# Altium project WeatherStationMain.PrjPCB
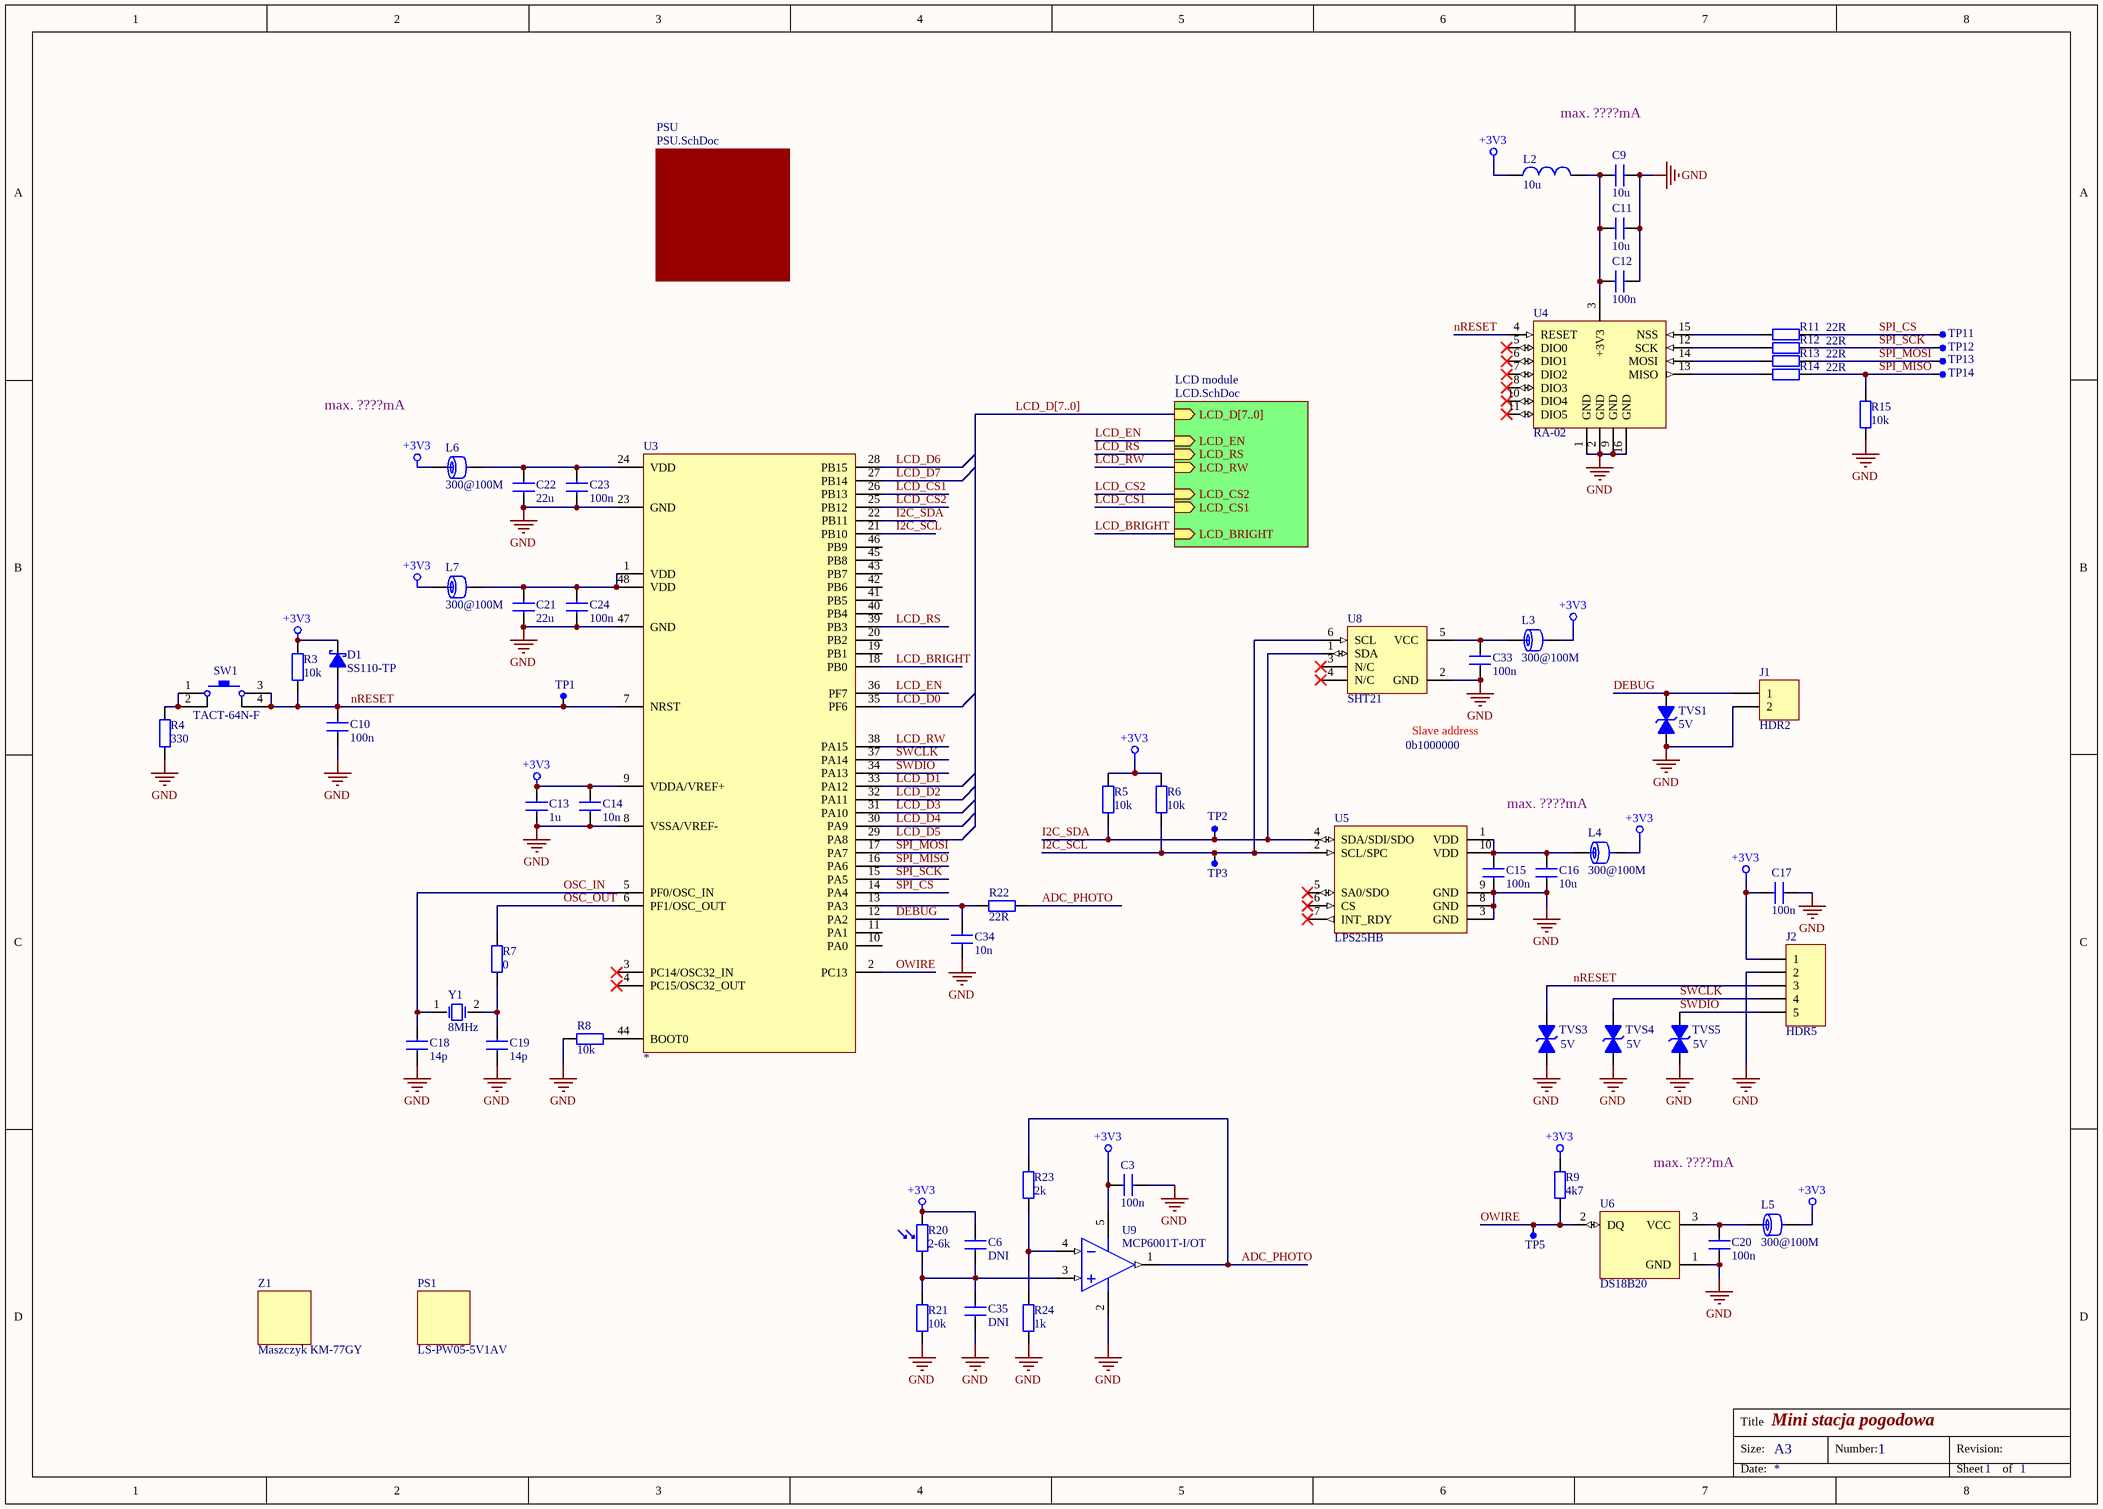
[diagram p0: Main.SchDoc]
.revision: 1.0
3 sheets, 109 parts. Net scope: hierarchical (ports join the sheet entries above them; power ports are global).
Board file: PCB.PcbDoc
Sheets:
  Main.SchDoc
    LCD module = LCD.SchDoc
    PSU = PSU.SchDoc

## Sheet Main.SchDoc: Mini stacja pogodowa
size A3; DrawnBy: Damian Dolewski; Engineer: Damian Dolewski; DocumentNumber: 1; Revision: 1.0; SheetNumber: 1; SheetTotal: 1

### Parts
C3  value 100n  [C_0805]  (hidden comment: Capacitor)
C6  value DNI  [C_0805]  (hidden comment: Capacitor)
C9  value 10u  [C_0805]  (hidden comment: Capacitor)
C10  value 100n  [C_0805]  (hidden comment: Capacitor)
C11  value 10u  [C_0805]  (hidden comment: Capacitor)
C12  value 100n  [C_0805]  (hidden comment: Capacitor)
C13  value 1u  [C_0805]  (hidden comment: Capacitor)
C14  value 10n  [C_0805]  (hidden comment: Capacitor)
C15  value 100n  [C_0805]  (hidden comment: Capacitor)
C16  value 10u  [C_0805]  (hidden comment: Capacitor)
C17  value 100n  [C_0805]  (hidden comment: Capacitor)
C18  value 14p  [C_0805]  (hidden comment: Capacitor)
C19  value 14p  [C_0805]  (hidden comment: Capacitor)
C20  value 100n  [C_0805]  (hidden comment: Capacitor)
C21  value 22u  [C_0805]  (hidden comment: Capacitor)
C22  value 22u  [C_0805]  (hidden comment: Capacitor)
C23  value 100n  [C_0805]  (hidden comment: Capacitor)
C24  value 100n  [C_0805]  (hidden comment: Capacitor)
C33  value 100n  [C_0805]  (hidden comment: Capacitor)
C34  value 10n  [C_0805]  (hidden comment: Capacitor)
C35  value DNI  [C_0805]  (hidden comment: Capacitor)
D1  SS110-TP  [D_1206]
J1  value HDR2  [header 2.54mm 2pin]  (hidden comment: Header 2)
J2  value HDR5  [header 2.54mm 5pin]  (hidden comment: Header 5)
L2  value 10u  [L_0805]  (hidden comment: Inductor)
L3  value 300@100M  [L_0805]  (hidden comment: 742792031)
L4  value 300@100M  [L_0805]  (hidden comment: 742792031)
L5  value 300@100M  [L_0805]  (hidden comment: 742792031)
L6  value 300@100M  [L_0805]  (hidden comment: 742792031)
L7  value 300@100M  [L_0805]  (hidden comment: 742792031)
PS1  LS-PW05-5V1AV  (mechanical)
R3  value 10k  [R_0805]  (hidden comment: Resistor)
R4  value 330  [R_0805]  (hidden comment: Resistor)
R5  value 10k  [R_1206]  (hidden comment: Resistor)
R6  value 10k  [R_1206]  (hidden comment: Resistor)
R7  value 0  [R_0805]  (hidden comment: Resistor)
R8  value 10k  [R_1206]  (hidden comment: Resistor)
R9  value 4k7  [R_1206]  (hidden comment: Resistor)
R11  value 22R  [R_0805]  (hidden comment: Resistor)
R12  value 22R  [R_0805]  (hidden comment: Resistor)
R13  value 22R  [R_0805]  (hidden comment: Resistor)
R14  value 22R  [R_0805]  (hidden comment: Resistor)
R15  value 10k  [R_1206]  (hidden comment: Resistor)
R20  value 2-6k  [Photoresistor]  (hidden comment: PGM5506-MP)
R21  value 10k  [R_1206]  (hidden comment: Resistor)
R22  value 22R  [R_0805]  (hidden comment: Resistor)
R23  value 2k  [R_1206]  (hidden comment: Resistor)
R24  value 1k  [R_1206]  (hidden comment: Resistor)
SW1  value TACT-64N-F  [SPST_NO_1301]  (hidden comment: Switch-PB 4 Pins)
TP1  TEST PAD  [PIN]  (value not drawn)
TP2  TEST PAD  [PIN]  (value not drawn)
TP3  TEST PAD  [PIN]  (value not drawn)
TP5  TEST PAD  [PIN]  (value not drawn)
TP11  TEST PAD  [PIN]  (value not drawn)
TP12  TEST PAD  [PIN]  (value not drawn)
TP13  TEST PAD  [PIN]  (value not drawn)
TP14  TEST PAD  [PIN]  (value not drawn)
TVS1  value 5V  [D_1206]  (hidden comment: SMAJ5.0ALFCT-ND)
TVS3  value 5V  [D_SMA]  (hidden comment: SMAJ5.0ALFCT-ND)
TVS4  value 5V  [D_SMA]  (hidden comment: SMAJ5.0ALFCT-ND)
TVS5  value 5V  [D_SMA]  (hidden comment: SMAJ5.0ALFCT-ND)
U3  STM32F030C6T6  [LQFP-48]  (value not drawn)
U4  value RA-02  [RA-02]  (hidden comment: LoRa RA-02 SX1278 433MHz)
U5  LPS25HB  [LPS25HB]
U6  DS18B20  [TO-92]
U8  SHT21  [DFN6]
U9  value MCP6001T-I/OT  [SOT23-5]  (hidden comment: MCP6001T)
Y1  value 8MHz  [CFPX_217]  (hidden comment: 7A-8.000MAAE-T)
Z1  Maszczyk KM-77GY  [KM-77GY]

### Sub-sheets
LCD module = LCD.SchDoc: LCD_D[7..0] (in), LCD_CS1 (in), LCD_EN (in), LCD_RS (in), LCD_RW (in), LCD_CS2 (in), LCD_BRIGHT (in)
PSU = PSU.SchDoc: no entries

### Nets
+3V3: C3.2 C6.1 C13.2 C14.2 C17.2 D1.2(K) J2.1 L2.1 L3.2 L4.2 L5.2 L6.1 L7.1 R3.2 R5.2 R6.2 R9.2 R20.1 U3.9(VDDA/VREF+) U9.5(VCC+)
GND: C3.1 C9.1 C10.1 C11.1 C12.1 C13.1 C14.1 C15.1 C16.1 C17.1 C18.1 C19.1 C20.1 C21.2 C22.2 C23.2 C24.2 C33.1 C34.1 C35.2 J1.2 J2.2 R4.1 R8.2 R15.1 R21.1 R24.1 TVS1.1(A) TVS3.1(A) TVS4.1(A) TVS5.1(A) U3.8(VSSA/VREF-) U3.23(GND) U3.47(GND) U4.1(GND) U4.2(GND) U4.9(GND) U4.16(GND) U5.3(GND) U5.8(GND) U5.9(GND) U6.1(GND) U8.2(GND) U9.2(VCC-)
ADC_PHOTO: R22.1 R23.2 U9.1(OUT)
DEBUG: J1.1 TVS1.2(K) U3.12(PA2)
I2C_SCL: R6.1 TP3.1 U3.21(PB10) U5.2(SCL/SPC) U8.6(SCL)
I2C_SDA: R5.1 TP2.1 U3.22(PB11) U5.4(SDA/SDI/SDO) U8.1(SDA)
LCD_BRIGHT: U3.18(PB0) ; sheet LCD module/LCD_BRIGHT
LCD_CS1: U3.26(PB13) ; sheet LCD module/LCD_CS1
LCD_CS2: U3.25(PB12) ; sheet LCD module/LCD_CS2
LCD_D0: U3.35(PF6)
LCD_D1: U3.33(PA12)
LCD_D2: U3.32(PA11)
LCD_D3: U3.31(PA10)
LCD_D4: U3.30(PA9)
LCD_D5: U3.29(PA8)
LCD_D6: U3.28(PB15)
LCD_D7: U3.27(PB14)
LCD_EN: U3.36(PF7) ; sheet LCD module/LCD_EN
LCD_RS: U3.39(PB3) ; sheet LCD module/LCD_RS
LCD_RW: U3.38(PA15) ; sheet LCD module/LCD_RW
nRESET: C10.2 D1.1(A) J2.3 R3.1 SW1.3 SW1.4 TP1.1 TVS3.2(K) U3.7(NRST) U4.4(RESET)
OSC_IN: C18.2 U3.5(PF0/OSC_IN) Y1.1(OSC1)
OSC_OUT: R7.2 U3.6(PF1/OSC_OUT)
OWIRE: R9.1 TP5.1 U3.2(PC13) U6.2(DQ)
SPI_CS: R11.1 TP11.1 U3.14(PA4)
SPI_MISO: R14.1 R15.2 TP14.1 U3.16(PA6)
SPI_MOSI: R13.1 TP13.1 U3.17(PA7)
SPI_SCK: R12.1 TP12.1 U3.15(PA5)
SWCLK: J2.4 TVS4.2(K) U3.37(PA14)
SWDIO: J2.5 TVS5.2(K) U3.34(PA13)
NetC6_2: C6.2 C35.1 R20.2 R21.2 U9.3(IN+)
NetC9_2: C9.2 C11.2 C12.2 L2.2 U4.3(+3V3)
NetC15_2: C15.2 C16.2 L4.1 U5.1(VDD) U5.10(VDD)
NetC19_2: C19.2 R7.1 Y1.2(OSC2)
NetC20_2: C20.2 L5.1 U6.3(VCC)
NetC21_1: C21.1 C24.1 L7.2 U3.1(VDD) U3.48(VDD)
NetC22_1: C22.1 C23.1 L6.2 U3.24(VDD)
NetC33_2: C33.2 L3.1 U8.5(VCC)
NetC34_2: C34.2 R22.2 U3.13(PA3)
NetR4_2: R4.2 SW1.1 SW1.2
NetR8_1: R8.1 U3.44(BOOT0)
NetR11_2: R11.2 U4.15(NSS)
NetR12_2: R12.2 U4.12(SCK)
NetR13_2: R13.2 U4.14(MOSI)
NetR14_2: R14.2 U4.13(MISO)
NetR23_1: R23.1 R24.2 U9.4(IN-)

Not connected (* = marked no-connect by the designer): U3 3(PC14/OSC32_IN)* 4(PC15/OSC32_OUT)* 10(PA0) 11(PA1) 19(PB1) 20(PB2) 40(PB4) 41(PB5) 42(PB6) 43(PB7) 45(PB8) 46(PB9); U4 5(DIO0)* 6(DIO1)* 7(DIO2)* 8(DIO3)* 10(DIO4)* 11(DIO5)*; U5 5(SA0/SDO)* 6(CS)* 7(INT_RDY)*; U8 3(N/C)* 4(N/C)*

### Buses and harness runs
bus LCD_D[7..0] = sheet LCD module/LCD_D[7..0]

### Notes on the sheet
- max. ????mA
- 0b1000000
- (near U8) Slave address
- Title
- Size:
- A3
- Number:
- Revision:
- Date:
- Sheet
- of

### Library data of the parts
D1 = Diode Schottky: Schottky Diode; Value: SS110-TP
J1 = Header 2: Header, 2-Pin
J2 = Header 5: Header, 5-Pin
L3-L7 = FB: Ferrite Bead
PS1 = LS-PW05-5V1AV: 5VDC; 1A; EU; 82,7%
R20 = Resistor Photo: Photo Resistor
SW1 = Switch-PB 4 Pins: Switch 4 Pins
TP1 TP11-TP14 = TEST_PAD: PAD 1.5mm
TP2 TP3 TP5 = TEST_PAD
TVS1 TVS3-TVS5 = Transil
U3 = STM32F030C6T6: Microcontroler ARM; Flash: 32kB; 48MHz; SRAM: 4kB; LQFP48; Value: *
U4 = RA-02 SX1278
U5 = LPS25HB: MEMS pressure sensor: 260-1260 hPa absolute digital output barometer, HCLGA10, STM, RoHS; Value: LPS25HB
U6 = DS18B20: DS18B20  Programmable Resolution  1-Wire Digital Thermometer
U8 = SHT21: Humidity and Temperature Sensor IC; Value: SHT21
U9 = MCP6001T: Rail to Rail Operational Amplifier
Y1 = XTAL: Crystal Oscillator
Z1 = KM-77GY: X:80mm; Y:120mm; Z:31mm; ABS; gray

## Sheet LCD.SchDoc: LCD 12x64 graficzny + translatory
size A4; DrawnBy: Damian Dolewski; Engineer: Damian Dolewski; DocumentNumber: 1; Revision: 1.0; SheetNumber: 1; SheetTotal: 1
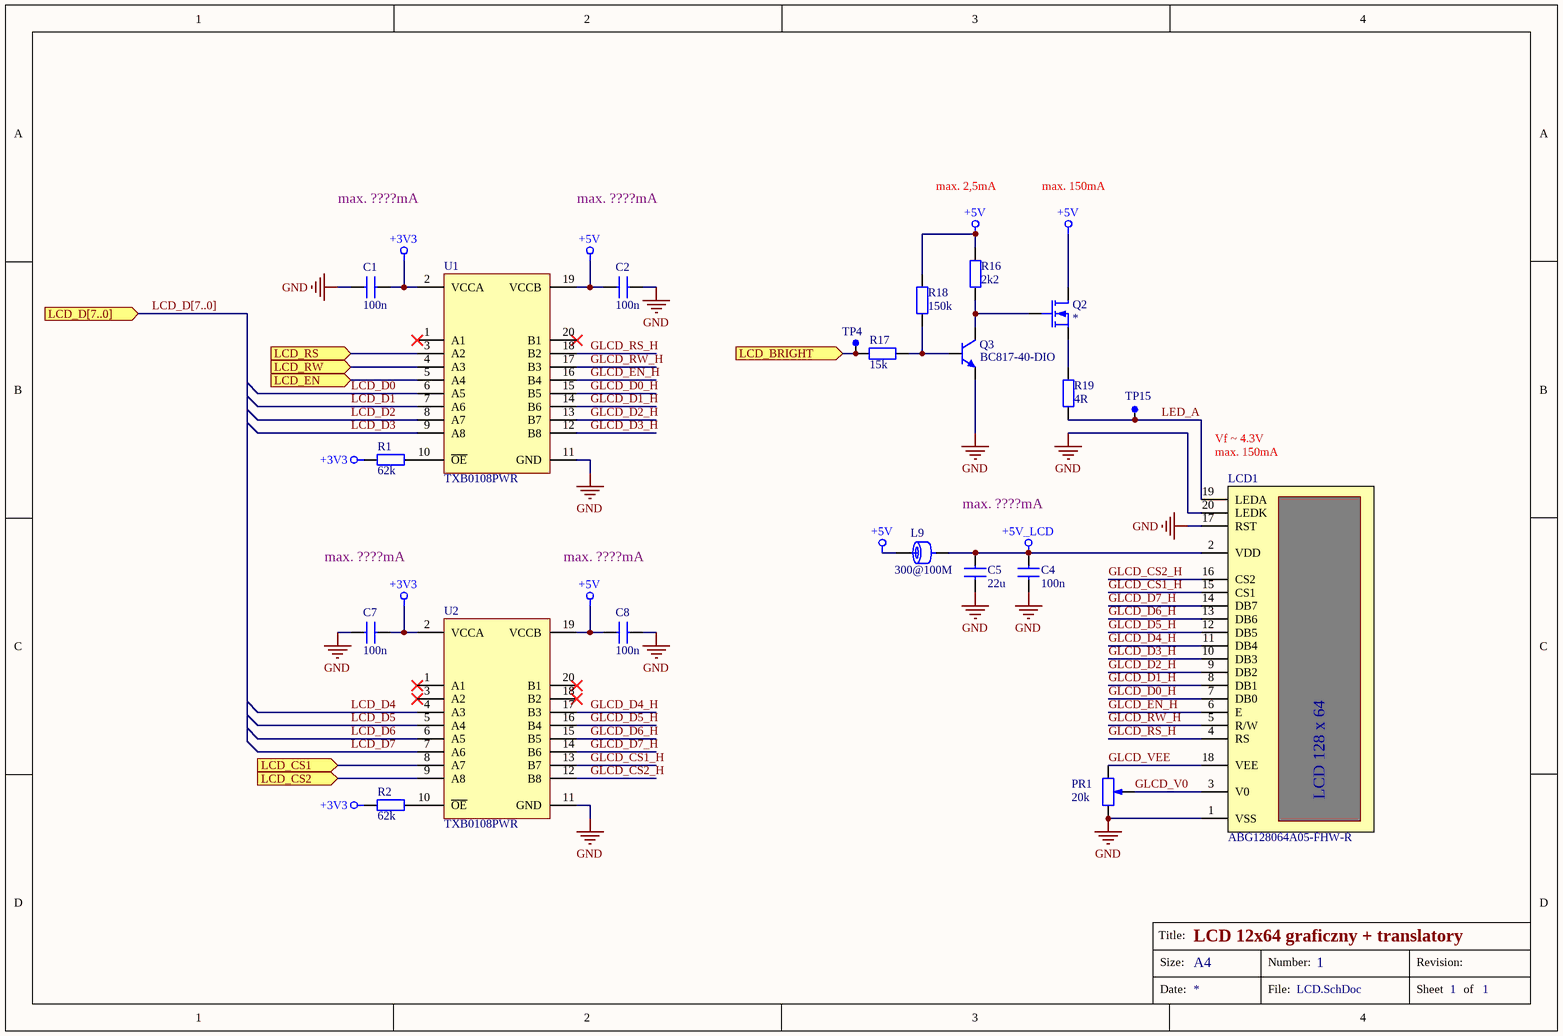
[diagram p1: LCD.SchDoc]

### Parts
C1  value 100n  [C_0805]  (hidden comment: Capacitor)
C2  value 100n  [C_0805]  (hidden comment: Capacitor)
C4  value 100n  [C_0805]  (hidden comment: Capacitor)
C5  value 22u  [C_0805]  (hidden comment: Capacitor)
C7  value 100n  [C_0805]  (hidden comment: Capacitor)
C8  value 100n  [C_0805]  (hidden comment: Capacitor)
L9  value 300@100M  [L_0805]  (hidden comment: 742792031)
LCD1  ABG128064A05-FHW-R  [GLCD]
PR1  T67W-20K  [1804 potentiometer]  (value not drawn)
Q2  MOSFET-N  [SOT-23]  (value not drawn)
Q3  BC817-40-DIO  [SOT-23]
R1  value 62k  [R_0805]  (hidden comment: Resistor)
R2  value 62k  [R_0805]  (hidden comment: Resistor)
R16  value 2k2  [R_0805]  (hidden comment: Resistor)
R17  value 15k  [R_0805]  (hidden comment: Resistor)
R18  value 150k  [R_0805]  (hidden comment: Resistor)
R19  value 4R  [R_1206]  (hidden comment: Resistor)
TP4  TEST PAD  [PIN]  (value not drawn)
TP15  TEST PAD  [PIN]  (value not drawn)
U1  TXB0108PWR  [TSSOP20]
U2  TXB0108PWR  [TSSOP20]

### Ports
LCD_BRIGHT (in), LCD_CS1 (in), LCD_CS2 (in), LCD_D[7..0] (in), LCD_EN (in), LCD_RS (in), LCD_RW (in)

### Nets
+3V3: C1.1 C7.1 R1.1 R2.1 U1.2(VCCA) U2.2(VCCA)
+5V: C2.2 C8.2 L9.1 Q2.3(D) R16.2 R18.2 U1.19(VCCB) U2.19(VCCB)
+5V_LCD: C4.1 C5.1 L9.2 LCD1.2(VDD)
GND: C1.2 C2.1 C4.2 C5.2 C7.2 C8.1 LCD1.1(VSS) LCD1.17(RST) LCD1.20(LEDK) PR1.1(BOT) Q3.2(E) U1.11(GND) U2.11(GND)
GLCD_CS1_H: LCD1.15(CS1) U2.13(B7)
GLCD_CS2_H: LCD1.16(CS2) U2.12(B8)
GLCD_D0_H: LCD1.7(DB0) U1.15(B5)
GLCD_D1_H: LCD1.8(DB1) U1.14(B6)
GLCD_D2_H: LCD1.9(DB2) U1.13(B7)
GLCD_D3_H: LCD1.10(DB3) U1.12(B8)
GLCD_D4_H: LCD1.11(DB4) U2.17(B3)
GLCD_D5_H: LCD1.12(DB5) U2.16(B4)
GLCD_D6_H: LCD1.13(DB6) U2.15(B5)
GLCD_D7_H: LCD1.14(DB7) U2.14(B6)
GLCD_EN_H: LCD1.6(E) U1.16(B4)
GLCD_RS_H: LCD1.4(RS) U1.18(B2)
GLCD_RW_H: LCD1.5(R/W) U1.17(B3)
GLCD_V0: LCD1.3(V0) PR1.2(TAP)
GLCD_VEE: LCD1.18(VEE) PR1.3(TOP)
LCD_BRIGHT: R17.1 TP4.1 ; port LCD_BRIGHT
LCD_CS1: U2.8(A7) ; port LCD_CS1
LCD_CS2: U2.9(A8) ; port LCD_CS2
LCD_D0: U1.6(A5)
LCD_D1: U1.7(A6)
LCD_D2: U1.8(A7)
LCD_D3: U1.9(A8)
LCD_D4: U2.4(A3)
LCD_D5: U2.5(A4)
LCD_D6: U2.6(A5)
LCD_D7: U2.7(A6)
LCD_EN: U1.5(A4) ; port LCD_EN
LCD_RS: U1.3(A2) ; port LCD_RS
LCD_RW: U1.4(A3) ; port LCD_RW
LED_A: LCD1.19(LEDA) R19.2 TP15.1
NetQ2_1: Q2.1(G) Q3.3(C) R16.1
NetQ2_2: Q2.2(S) R19.1
NetQ3_1: Q3.1(B) R17.2 R18.1
NetR1_2: R1.2 U1.10(~{OE})
NetR2_2: R2.2 U2.10(~{OE})

Not connected (* = marked no-connect by the designer): U1 1(A1)* 20(B1)*; U2 1(A1)* 3(A2)* 18(B2)* 20(B1)*

### Buses and harness runs
bus LCD_D[7..0] = port LCD_D[7..0]

### Notes on the sheet
- max. ????mA
- max. 2,5mA
- max. 150mA
- Vf ~ 4.3V
- (near LCD1) max. 150mA
- Title:
- Size:
- A4
- Number:
- Revision:
- Date:
- File:
- Sheet
- of
- (in symbol LCD 128x64) LCD 128 x 64
- (in symbol Potentiometer) 20k

### Library data of the parts
L9 = FB: Ferrite Bead
LCD1 = LCD 128x64: Graphic LCD 128x64
PR1 = Potentiometer: 3 pin Potentiometer
Q2 = MOSFET-N: N-Channel MOSFET; Value: *
Q3 = NPN: NPN Bipolar Transistor; Value: BC817-40-DIO
TP4 TP15 = TEST_PAD: PAD 1.5mm
U1 U2 = TXB0108: TXB0108 8-Bit Bidirectional Voltage-Level Translator with Auto-Direction Sensing and  ±15-kV ESD Protection; Value: TXB0108PWR

## Sheet PSU.SchDoc: 3V3 LDO
size A4; DrawnBy: Damian Dolewski; Engineer: Damian Dolewski; DocumentNumber: 1; Revision: 1.0; SheetNumber: 1; SheetTotal: 1
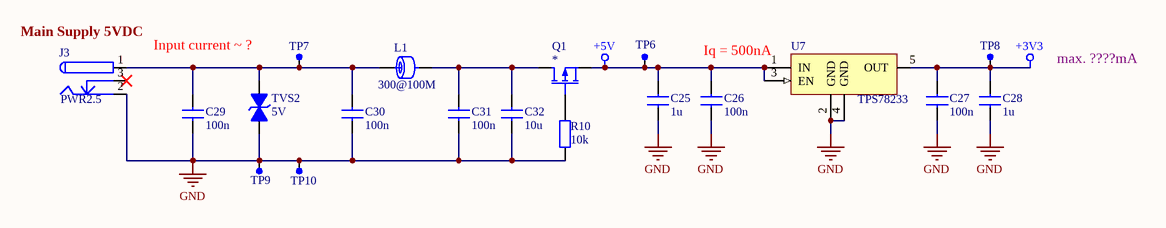
[diagram p2: PSU.SchDoc]

### Parts
C25  value 1u  [C_0805]  (hidden comment: Capacitor)
C26  value 100n  [C_0805]  (hidden comment: Capacitor)
C27  value 100n  [C_0805]  (hidden comment: Capacitor)
C28  value 1u  [C_0805]  (hidden comment: Capacitor)
C29  value 100n  [C_0805]  (hidden comment: Capacitor)
C30  value 100n  [C_0805]  (hidden comment: Capacitor)
C31  value 100n  [C_0805]  (hidden comment: Capacitor)
C32  value 10u  [C_0805]  (hidden comment: Capacitor)
J3  PWR2.5  [WE_WR_DC_694106301002]
L1  value 300@100M  [L_0805]  (hidden comment: 742792031)
Q1  MOSFET-P  [SOT-23]  (value not drawn)
R10  value 10k  [R_0805]  (hidden comment: Resistor)
TP6  TEST PAD  [PIN]  (value not drawn)
TP7  TEST PAD  [PIN]  (value not drawn)
TP8  TEST PAD  [PIN]  (value not drawn)
TP9  TEST PAD  [PIN]  (value not drawn)
TP10  TEST PAD  [PIN]  (value not drawn)
TVS2  value 5V  [D_1206]  (hidden comment: SMAJ5.0ALFCT-ND)
U7  TPS78233  [SOP5(6)]

### Nets
+3V3: C27.1 C28.1 TP8.1 U7.5(OUT)
+5V: C25.1 C26.1 Q1.2(S) TP6.1 U7.1(IN) U7.3(EN)
GND: C25.2 C26.2 C27.2 C28.2 C29.2 C30.2 C31.2 C32.2 J3.2 R10.1 TP9.1 TP10.1 TVS2.1(A) U7.2(GND) U7.4(GND)
NetC29_1: C29.1 C30.1 J3.1 L1.1 TP7.1 TVS2.2(K)
NetC31_1: C31.1 C32.1 L1.2 Q1.3(D)
NetQ1_1: Q1.1(G) R10.2

Not connected (* = marked no-connect by the designer): J3 3*

### Notes on the sheet
- (near J3) Main Supply 5VDC
- (near TP7) Input current ~ ?
- (near U7) Iq = 500nA
- max. ????mA
- Title:
- Size:
- A4
- Number:
- Revision:
- Date:
- File:
- Sheet
- of

### Library data of the parts
J3 = PWR2.5: Low Voltage Power Supply Connector; ComponentLink1Description: Manufacturer Link; ComponentLink1URL: http://domino.kycon.com/internet/Products.html; Value: PWR2.5
L1 = FB: Ferrite Bead
Q1 = MOSFET-P: P-Channel MOSFET; Value: *
TP6-TP10 = TEST_PAD: PAD 1.5mm
TVS2 = Transil
U7 = TPS78233: 150-mA, ultra-low quiescent qurrent (500 nA) low-dropout linear regulator; Value: TPS78233

## Nets that join several sheets
+3V3: Main (20 pins), LCD (6 pins), PSU (C27.1 C28.1 TP8.1 U7.5)
+5V: LCD (8 pins), PSU (6 pins)
GND: Main (44 pins), LCD (13 pins), PSU (15 pins)
LCD_BRIGHT: Main (U3.18), LCD (R17.1 TP4.1)
LCD_CS1: Main (U3.26), LCD (U2.8)
LCD_CS2: Main (U3.25), LCD (U2.9)
LCD_D0: Main (U3.35), LCD (U1.6)
LCD_D1: Main (U3.33), LCD (U1.7)
LCD_D2: Main (U3.32), LCD (U1.8)
LCD_D3: Main (U3.31), LCD (U1.9)
LCD_D4: Main (U3.30), LCD (U2.4)
LCD_D5: Main (U3.29), LCD (U2.5)
LCD_D6: Main (U3.28), LCD (U2.6)
LCD_D7: Main (U3.27), LCD (U2.7)
LCD_EN: Main (U3.36), LCD (U1.5)
LCD_RS: Main (U3.39), LCD (U1.3)
LCD_RW: Main (U3.38), LCD (U1.4)

## Assembly variants
Default: not fitted C6 C35